# Altium schematic sheet Sheet_prototype.SchDoc
size A4
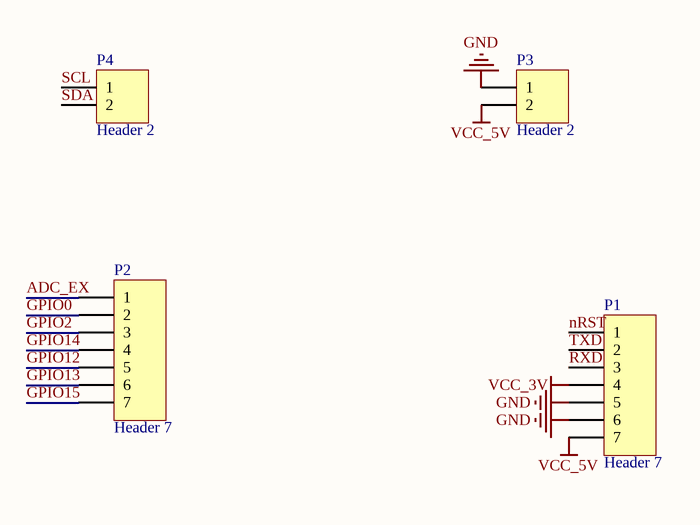
[diagram p0: Sheet_prototype.SchDoc]

## Parts
P1  Header 7  [HDR1X7]
P2  Header 7  [HDR1X7]
P3  Header 2  [HDR1X2]
P4  Header 2  [HDR1X2]

## Nets
GND: P1.5 P1.6 P3.1
VCC_3V: P1.4
VCC_5V: P1.7 P3.2
ADC_EX: P2.1
GPIO0: P2.2
GPIO2: P2.3
GPIO12: P2.5
GPIO13: P2.6
GPIO14: P2.4
GPIO15: P2.7
nRST: P1.1
RXD: P1.3
SCL: P4.1
SDA: P4.2
TXD: P1.2

## Library data of the parts
P1 P2 = Header 7: Header, 7-Pin; LatestRevisionDate: 17-Jul-2002; LatestRevisionNote: Re-released for DXP Platform.; Publisher: Altium Limited
P3 P4 = Header 2: Header, 2-Pin; LatestRevisionDate: 17-Jul-2002; LatestRevisionNote: Re-released for DXP Platform.; Publisher: Altium Limited